# Altium schematic sheet 09-Connectors.SchDoc
size A
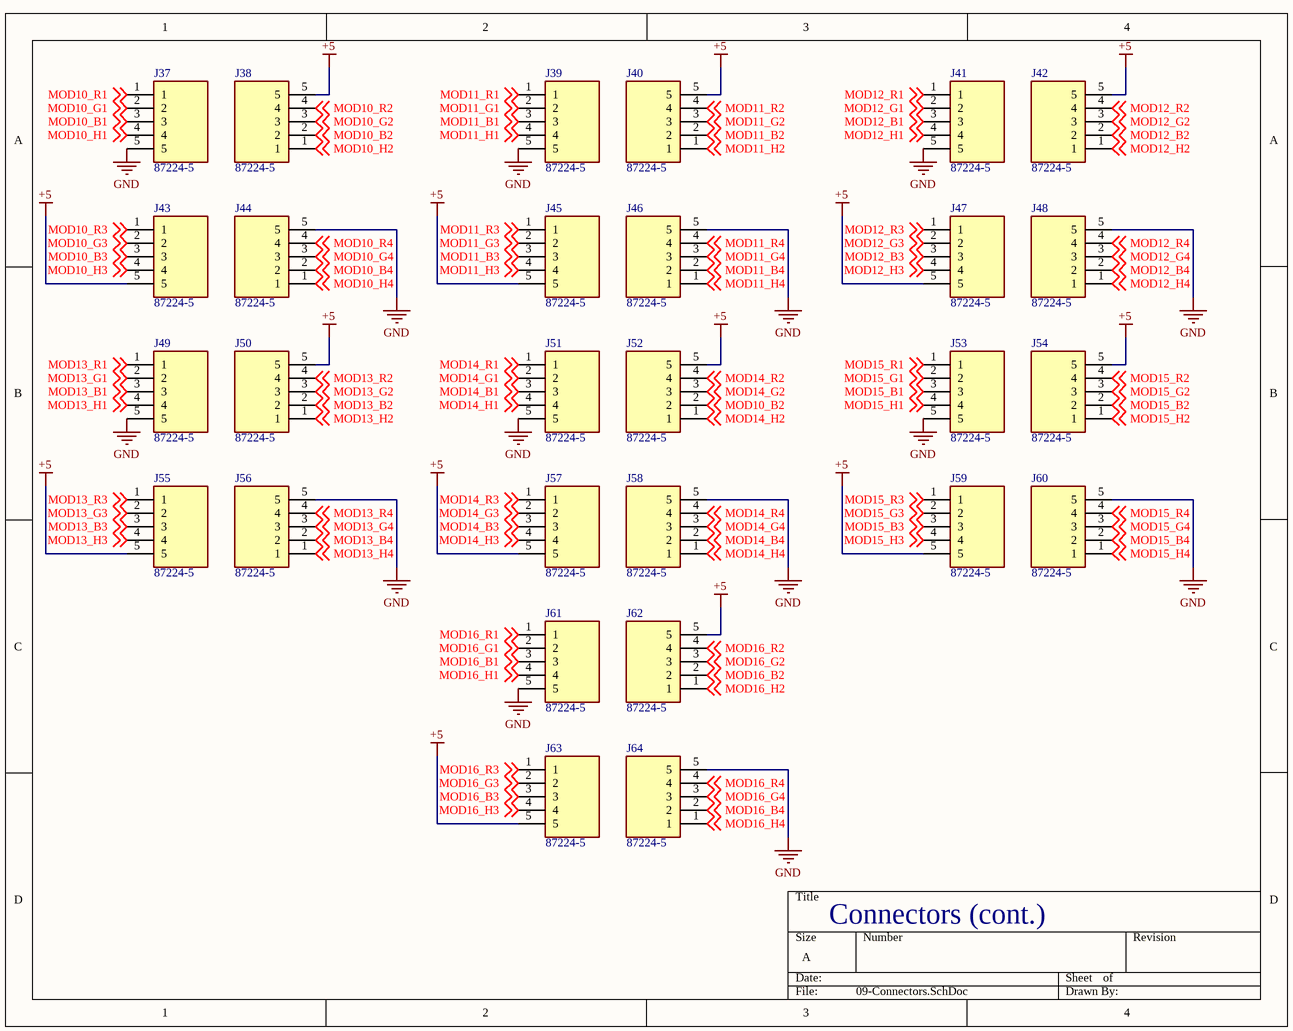
[diagram p0: 09-Connectors.SchDoc]

## Parts
J37  87224-5  [TE_87224-5]
J38  87224-5  [TE_87224-5]
J39  87224-5  [TE_87224-5]
J40  87224-5  [TE_87224-5]
J41  87224-5  [TE_87224-5]
J42  87224-5  [TE_87224-5]
J43  87224-5  [TE_87224-5]
J44  87224-5  [TE_87224-5]
J45  87224-5  [TE_87224-5]
J46  87224-5  [TE_87224-5]
J47  87224-5  [TE_87224-5]
J48  87224-5  [TE_87224-5]
J49  87224-5  [TE_87224-5]
J50  87224-5  [TE_87224-5]
J51  87224-5  [TE_87224-5]
J52  87224-5  [TE_87224-5]
J53  87224-5  [TE_87224-5]
J54  87224-5  [TE_87224-5]
J55  87224-5  [TE_87224-5]
J56  87224-5  [TE_87224-5]
J57  87224-5  [TE_87224-5]
J58  87224-5  [TE_87224-5]
J59  87224-5  [TE_87224-5]
J60  87224-5  [TE_87224-5]
J61  87224-5  [TE_87224-5]
J62  87224-5  [TE_87224-5]
J63  87224-5  [TE_87224-5]
J64  87224-5  [TE_87224-5]

## Nets
+5: J38.5 J40.5 J42.5 J43.5 J45.5 J47.5 J50.5 J52.5 J54.5 J55.5 J57.5 J59.5 J62.5 J63.5
GND: J37.5 J39.5 J41.5 J44.5 J46.5 J48.5 J49.5 J51.5 J53.5 J56.5 J58.5 J60.5 J61.5 J64.5
MOD10_B1: J37.3 ; off-sheet MOD10_B1
MOD10_B2: J38.2 J52.2 ; off-sheet MOD10_B2
MOD10_B3: J43.3 ; off-sheet MOD10_B3
MOD10_B4: J44.2 ; off-sheet MOD10_B4
MOD10_G1: J37.2 ; off-sheet MOD10_G1
MOD10_G2: J38.3 ; off-sheet MOD10_G2
MOD10_G3: J43.2 ; off-sheet MOD10_G3
MOD10_G4: J44.3 ; off-sheet MOD10_G4
MOD10_H1: J37.4 ; off-sheet MOD10_H1
MOD10_H2: J38.1 ; off-sheet MOD10_H2
MOD10_H3: J43.4 ; off-sheet MOD10_H3
MOD10_H4: J44.1 ; off-sheet MOD10_H4
MOD10_R1: J37.1 ; off-sheet MOD10_R1
MOD10_R2: J38.4 ; off-sheet MOD10_R2
MOD10_R3: J43.1 ; off-sheet MOD10_R3
MOD10_R4: J44.4 ; off-sheet MOD10_R4
MOD11_B1: J39.3 ; off-sheet MOD11_B1
MOD11_B2: J40.2 ; off-sheet MOD11_B2
MOD11_B3: J45.3 ; off-sheet MOD11_B3
MOD11_B4: J46.2 ; off-sheet MOD11_B4
MOD11_G1: J39.2 ; off-sheet MOD11_G1
MOD11_G2: J40.3 ; off-sheet MOD11_G2
MOD11_G3: J45.2 ; off-sheet MOD11_G3
MOD11_G4: J46.3 ; off-sheet MOD11_G4
MOD11_H1: J39.4 ; off-sheet MOD11_H1
MOD11_H2: J40.1 ; off-sheet MOD11_H2
MOD11_H3: J45.4 ; off-sheet MOD11_H3
MOD11_H4: J46.1 ; off-sheet MOD11_H4
MOD11_R1: J39.1 ; off-sheet MOD11_R1
MOD11_R2: J40.4 ; off-sheet MOD11_R2
MOD11_R3: J45.1 ; off-sheet MOD11_R3
MOD11_R4: J46.4 ; off-sheet MOD11_R4
MOD12_B1: J41.3 ; off-sheet MOD12_B1
MOD12_B2: J42.2 ; off-sheet MOD12_B2
MOD12_B3: J47.3 ; off-sheet MOD12_B3
MOD12_B4: J48.2 ; off-sheet MOD12_B4
MOD12_G1: J41.2 ; off-sheet MOD12_G1
MOD12_G2: J42.3 ; off-sheet MOD12_G2
MOD12_G3: J47.2 ; off-sheet MOD12_G3
MOD12_G4: J48.3 ; off-sheet MOD12_G4
MOD12_H1: J41.4 ; off-sheet MOD12_H1
MOD12_H2: J42.1 ; off-sheet MOD12_H2
MOD12_H3: J47.4 ; off-sheet MOD12_H3
MOD12_H4: J48.1 ; off-sheet MOD12_H4
MOD12_R1: J41.1 ; off-sheet MOD12_R1
MOD12_R2: J42.4 ; off-sheet MOD12_R2
MOD12_R3: J47.1 ; off-sheet MOD12_R3
MOD12_R4: J48.4 ; off-sheet MOD12_R4
MOD13_B1: J49.3 ; off-sheet MOD13_B1
MOD13_B2: J50.2 ; off-sheet MOD13_B2
MOD13_B3: J55.3 ; off-sheet MOD13_B3
MOD13_B4: J56.2 ; off-sheet MOD13_B4
MOD13_G1: J49.2 ; off-sheet MOD13_G1
MOD13_G2: J50.3 ; off-sheet MOD13_G2
MOD13_G3: J55.2 ; off-sheet MOD13_G3
MOD13_G4: J56.3 ; off-sheet MOD13_G4
MOD13_H1: J49.4 ; off-sheet MOD13_H1
MOD13_H2: J50.1 ; off-sheet MOD13_H2
MOD13_H3: J55.4 ; off-sheet MOD13_H3
MOD13_H4: J56.1 ; off-sheet MOD13_H4
MOD13_R1: J49.1 ; off-sheet MOD13_R1
MOD13_R2: J50.4 ; off-sheet MOD13_R2
MOD13_R3: J55.1 ; off-sheet MOD13_R3
MOD13_R4: J56.4 ; off-sheet MOD13_R4
MOD14_B1: J51.3 ; off-sheet MOD14_B1
MOD14_B3: J57.3 ; off-sheet MOD14_B3
MOD14_B4: J58.2 ; off-sheet MOD14_B4
MOD14_G1: J51.2 ; off-sheet MOD14_G1
MOD14_G2: J52.3 ; off-sheet MOD14_G2
MOD14_G3: J57.2 ; off-sheet MOD14_G3
MOD14_G4: J58.3 ; off-sheet MOD14_G4
MOD14_H1: J51.4 ; off-sheet MOD14_H1
MOD14_H2: J52.1 ; off-sheet MOD14_H2
MOD14_H3: J57.4 ; off-sheet MOD14_H3
MOD14_H4: J58.1 ; off-sheet MOD14_H4
MOD14_R1: J51.1 ; off-sheet MOD14_R1
MOD14_R2: J52.4 ; off-sheet MOD14_R2
MOD14_R3: J57.1 ; off-sheet MOD14_R3
MOD14_R4: J58.4 ; off-sheet MOD14_R4
MOD15_B1: J53.3 ; off-sheet MOD15_B1
MOD15_B2: J54.2 ; off-sheet MOD15_B2
MOD15_B3: J59.3 ; off-sheet MOD15_B3
MOD15_B4: J60.2 ; off-sheet MOD15_B4
MOD15_G1: J53.2 ; off-sheet MOD15_G1
MOD15_G2: J54.3 ; off-sheet MOD15_G2
MOD15_G3: J59.2 ; off-sheet MOD15_G3
MOD15_G4: J60.3 ; off-sheet MOD15_G4
MOD15_H1: J53.4 ; off-sheet MOD15_H1
MOD15_H2: J54.1 ; off-sheet MOD15_H2
MOD15_H3: J59.4 ; off-sheet MOD15_H3
MOD15_H4: J60.1 ; off-sheet MOD15_H4
MOD15_R1: J53.1 ; off-sheet MOD15_R1
MOD15_R2: J54.4 ; off-sheet MOD15_R2
MOD15_R3: J59.1 ; off-sheet MOD15_R3
MOD15_R4: J60.4 ; off-sheet MOD15_R4
MOD16_B1: J61.3 ; off-sheet MOD16_B1
MOD16_B2: J62.2 ; off-sheet MOD16_B2
MOD16_B3: J63.3 ; off-sheet MOD16_B3
MOD16_B4: J64.2 ; off-sheet MOD16_B4
MOD16_G1: J61.2 ; off-sheet MOD16_G1
MOD16_G2: J62.3 ; off-sheet MOD16_G2
MOD16_G3: J63.2 ; off-sheet MOD16_G3
MOD16_G4: J64.3 ; off-sheet MOD16_G4
MOD16_H1: J61.4 ; off-sheet MOD16_H1
MOD16_H2: J62.1 ; off-sheet MOD16_H2
MOD16_H3: J63.4 ; off-sheet MOD16_H3
MOD16_H4: J64.1 ; off-sheet MOD16_H4
MOD16_R1: J61.1 ; off-sheet MOD16_R1
MOD16_R2: J62.4 ; off-sheet MOD16_R2
MOD16_R3: J63.1 ; off-sheet MOD16_R3
MOD16_R4: J64.4 ; off-sheet MOD16_R4

## Notes on the sheet
- Connectors (cont.)

## Library data of the parts
J37-J64 = 87224-5: Conn Unshrouded Header HDR 5 POS 2.54mm Solder ST Thru-Hole; Number_of_Positions: 5; MF: TE Connectivity; Product_Type: Connector; Centerline_Pitch: 2.54 mm[.1 in]; Price: None; SnapEDA_Link: https://www.snapeda.com/parts/87224-5/TE%20Connectivity%20AMP%20Connectors/view-part/1233389/?ref=snap; EU_RoHS_Compliance: Compliant; MP: 87224-5; Value: *; Availability: Good; Package: None; Purchase-URL: https://pricing.snapeda.com/search/part/87224-5/?ref=eda